# Altium schematic sheet 485Driver_MAX3462.SchDoc
size A4
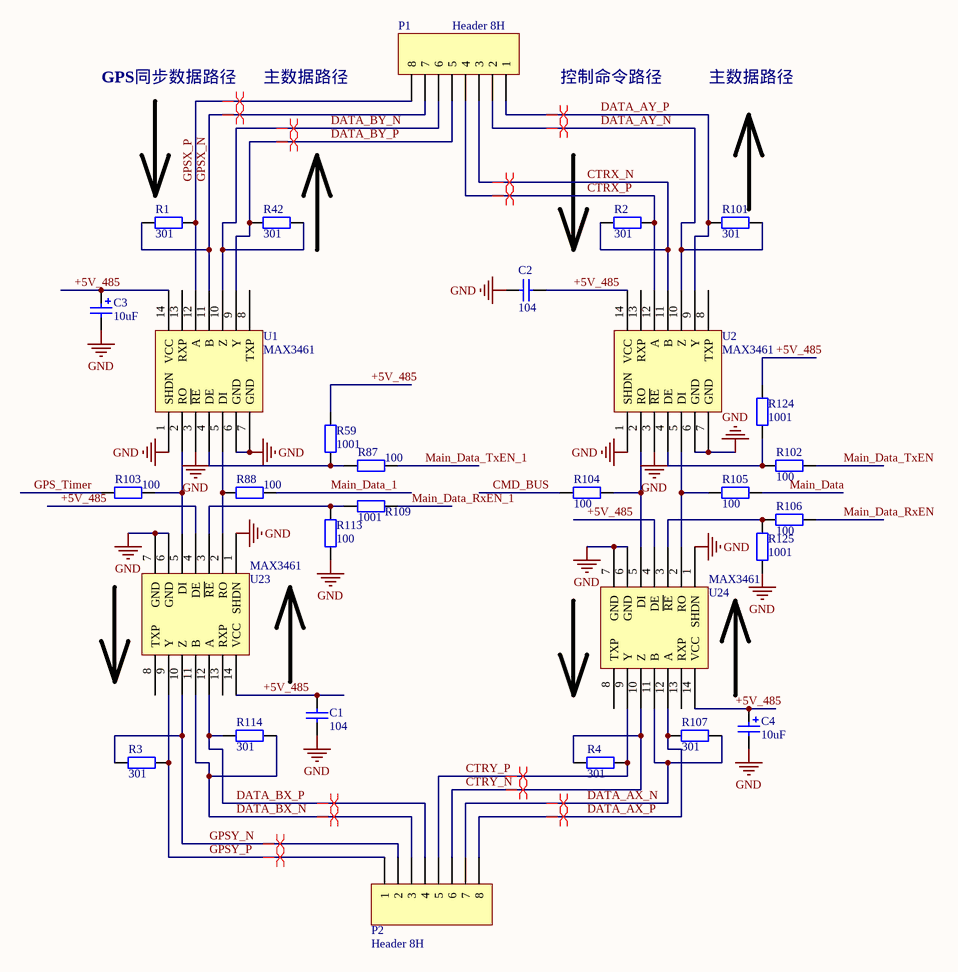
[diagram p0: 485Driver_MAX3462.SchDoc]

## Parts
C1  104  [0805C]
C2  104  [0805C]
C3  10uF  [C68uF]
C4  10uF  [C68uF]
P1  Header 8H  [HDR1X8H]
P2  Header 8H  [HDR1X8H]
R1  301  [0805R]
R2  301  [0805R]
R3  301  [0805R]
R4  301  [0805R]
R42  301  [0805R]
R59  1001  [0603]
R87  100  [0603]
R88  100  [0603]
R101  301  [0805R]
R102  100  [0603]
R103  100  [0603]
R104  100  [0603]
R105  100  [0603]
R106  100  [0603]
R107  301  [0805R]
R109  1001  [0603]
R113  100  [0603]
R114  301  [0805R]
R124  1001  [0603]
R125  1001  [0603]
U1  MAX3461  [SOP14]
U2  MAX3461  [SOP14]
U23  MAX3461  [SOP14]
U24  MAX3461  [SOP14]

## Nets
GND: C1.1 C2.1 C3.2 C4.2 R113.2 R125.2 U1.1(SHDN) U1.3(~{RE}) U1.6(GND) U1.7(GND) U2.1(SHDN) U2.3(~{RE}) U2.6(GND) U2.7(GND) U23.1(SHDN) U23.6(GND) U23.7(GND) U24.1(SHDN) U24.6(GND) U24.7(GND)
+5V_485: C1.2 C2.2 C3.1 C4.1 R59.1 R124.1 U1.14(VCC) U2.14(VCC) U23.4(DE) U23.14(VCC) U24.4(DE) U24.14(VCC)
CMD_BUS: R104.2
CTRX_N: P1.3 R2.2 U2.11(B)
CTRX_P: P1.4 R2.1 U2.12(A)
CTRY_N: P2.6 R4.2 U24.10(Z)
CTRY_P: P2.5 R4.1 U24.9(Y)
DATA_AX_N: P2.7 R107.1 U24.11(B)
DATA_AX_P: P2.8 R107.2 U24.12(A)
DATA_AY_N: P1.2 R101.1 U2.10(Z)
DATA_AY_P: P1.1 R101.2 U2.9(Y)
DATA_BX_N: P2.3 R114.1 U23.11(B)
DATA_BX_P: P2.4 R114.2 U23.12(A)
DATA_BY_N: P1.6 R42.1 U1.10(Z)
DATA_BY_P: P1.5 R42.2 U1.9(Y)
GPS_Timer: R103.2
GPSX_N: P1.7 R1.2 U1.11(B)
GPSX_P: P1.8 R1.1 U1.12(A)
GPSY_N: P2.2 R3.2 U23.10(Z)
GPSY_P: P2.1 R3.1 U23.9(Y)
Main_Data: R105.1
Main_Data_1: R88.1
Main_Data_RxEN: R106.1
Main_Data_RxEN_1: R109.2
Main_Data_TxEN: R102.1
Main_Data_TxEN_1: R87.1
NetR59_2: R59.2 R87.2 U1.4(DE)
NetR88_2: R88.2 U1.5(DI) U23.2(RO)
NetR102_2: R102.2 R124.2 U2.4(DE)
NetR103_1: R103.1 U1.2(RO) U23.5(DI)
NetR104_1: R104.1 U2.2(RO) U24.5(DI)
NetR105_2: R105.2 U2.5(DI) U24.2(RO)
NetR106_2: R106.2 R125.1 U24.3(~{RE})
NetR109_1: R109.1 R113.1 U23.3(~{RE})

Not connected (* = marked no-connect by the designer): U1 8(TXP) 13(RXP); U2 8(TXP) 13(RXP); U23 8(TXP) 13(RXP); U24 8(TXP) 13(RXP)

## Layout directives
differential pair: CTRX_N, CTRX_P, CTRY_N, CTRY_P, DATA_AX_N, DATA_AX_P, DATA_AY_N, DATA_AY_P, DATA_BX_N, DATA_BX_P, DATA_BY_N, DATA_BY_P, GPSX_N, GPSX_P, GPSY_N, GPSY_P

## Notes on the sheet
- GPS同步数据路径
- 主数据路径
- 控制命令路径

## Library data of the parts
C1 C2 = Cap: Capacitor; Value: 100nF; Published: 8-Jun-2000; LatestRevisionDate: 17-Jul-2002; LatestRevisionNote: Re-released for DXP Platform.; PackageReference: RAD-0.3; Publisher: Altium Limited
C3 C4 = Cap Pol2: Polarized Capacitor (Axial); Value: 100pF; Published: 8-Jun-2000; LatestRevisionDate: 17-Jul-2002; LatestRevisionNote: Re-released for DXP Platform.; PackageReference: POLAR0.8; Publisher: Altium Limited
P1 P2 = Header 8H: Header, 8-Pin, Right Angle; LatestRevisionDate: 17-Jul-2002; LatestRevisionNote: Re-released for DXP Platform.; Publisher: Altium Limited
R1-R4 R42 R59 R87 R88 R101-R107 R109 R113 R114 R124 R125 = Res2: Resistor; Value: 1K; Published: 8-Jun-2000; LatestRevisionDate: 17-Jul-2002; LatestRevisionNote: Re-released for DXP Platform.; PackageReference: AXIAL-0.4; Publisher: Altium Limited